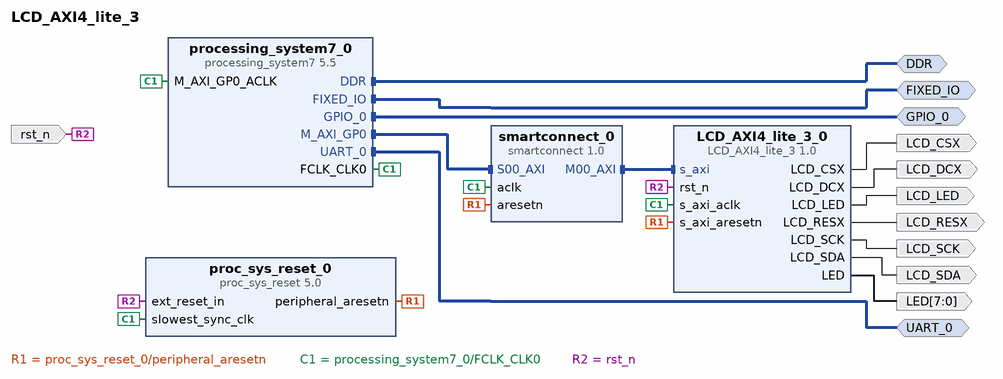
[diagram p0: block diagram of the top level]
# Vivado block design LCD_AXI4_lite_3, xc7z010clg400-1, Vivado 2025.1
create_bd_design LCD_AXI4_lite_3

create_bd_intf_port -mode Master -vlnv xilinx.com:interface:ddrx_rtl:1.0 DDR
create_bd_intf_port -mode Master -vlnv xilinx.com:display_processing_system7:fixedio_rtl:1.0 FIXED_IO
create_bd_intf_port -mode Master -vlnv xilinx.com:interface:gpio_rtl:1.0 GPIO_0
create_bd_intf_port -mode Master -vlnv xilinx.com:interface:uart_rtl:1.0 UART_0
create_bd_port -dir O -from 7 -to 0 LED
create_bd_port -dir O LCD_CSX
create_bd_port -dir O LCD_RESX
create_bd_port -dir O LCD_DCX
create_bd_port -dir O LCD_SDA
create_bd_port -dir O LCD_SCK
create_bd_port -dir O LCD_LED
create_bd_port -dir I -type rst rst_n

create_bd_cell -type ip -vlnv xilinx.com:ip:proc_sys_reset:5.0 proc_sys_reset_0
create_bd_cell -type ip -vlnv xilinx.com:ip:processing_system7:5.5 processing_system7_0
set_property -dict [list \
  CONFIG.PCW_EN_RST0_PORT 0 \
  CONFIG.PCW_GPIO_EMIO_GPIO_ENABLE 1 \
  CONFIG.PCW_GPIO_EMIO_GPIO_IO 64 \
  CONFIG.PCW_GPIO_MIO_GPIO_ENABLE 1 \
  CONFIG.PCW_GPIO_MIO_GPIO_IO MIO \
  CONFIG.PCW_I2C_RESET_ENABLE 1 \
  CONFIG.PCW_SD0_PERIPHERAL_ENABLE 0 \
  CONFIG.PCW_SD1_GRP_CD_ENABLE 1 \
  CONFIG.PCW_SD1_GRP_CD_IO {MIO 40} \
  CONFIG.PCW_SD1_GRP_WP_ENABLE 1 \
  CONFIG.PCW_SD1_GRP_WP_IO {MIO 41} \
  CONFIG.PCW_SD1_PERIPHERAL_ENABLE 1 \
  CONFIG.PCW_SD1_SD1_IO {MIO 34 .. 39} \
  CONFIG.PCW_SDIO_PERIPHERAL_FREQMHZ 100 \
  CONFIG.PCW_UART0_PERIPHERAL_ENABLE 1 \
  CONFIG.PCW_UART0_UART0_IO EMIO \
  CONFIG.PCW_UART1_PERIPHERAL_ENABLE 1 \
  CONFIG.PCW_UART1_UART1_IO {MIO 48 .. 49} \
  CONFIG.PCW_UART_PERIPHERAL_FREQMHZ 100 \
  CONFIG.PCW_UIPARAM_DDR_BUS_WIDTH {16 Bit} \
  CONFIG.PCW_UIPARAM_DDR_PARTNO {MT41J256M16 RE-125} \
  CONFIG.PCW_USB_RESET_ENABLE 1 \
] [get_bd_cells processing_system7_0]
# 204 more settings of processing_system7_0 are not shown: defaults, MIO pin electricals, DDR timing, and values the tool derives
create_bd_cell -type ip -vlnv xilinx.com:ip:smartconnect:1.0 smartconnect_0
set_property -dict {CONFIG.NUM_CLKS 1 CONFIG.NUM_SI 1} [get_bd_cells smartconnect_0]
create_bd_cell -type ip -vlnv user.org:user:LCD_AXI4_lite_3:1.0 LCD_AXI4_lite_3_0

# ---- connections ----

connect_bd_intf_net [get_bd_intf_ports DDR] [get_bd_intf_pins processing_system7_0/DDR]
connect_bd_intf_net [get_bd_intf_ports FIXED_IO] [get_bd_intf_pins processing_system7_0/FIXED_IO]
connect_bd_intf_net [get_bd_intf_pins processing_system7_0/GPIO_0] [get_bd_intf_ports GPIO_0]
connect_bd_intf_net [get_bd_intf_pins smartconnect_0/S00_AXI] [get_bd_intf_pins processing_system7_0/M_AXI_GP0]
connect_bd_intf_net [get_bd_intf_pins processing_system7_0/UART_0] [get_bd_intf_ports UART_0]
connect_bd_intf_net [get_bd_intf_pins LCD_AXI4_lite_3_0/s_axi] [get_bd_intf_pins smartconnect_0/M00_AXI]
connect_bd_net [get_bd_pins LCD_AXI4_lite_3_0/LCD_CSX] [get_bd_ports LCD_CSX]
connect_bd_net [get_bd_pins LCD_AXI4_lite_3_0/LCD_DCX] [get_bd_ports LCD_DCX]
connect_bd_net [get_bd_pins LCD_AXI4_lite_3_0/LCD_LED] [get_bd_ports LCD_LED]
connect_bd_net [get_bd_pins LCD_AXI4_lite_3_0/LCD_RESX] [get_bd_ports LCD_RESX]
connect_bd_net [get_bd_pins LCD_AXI4_lite_3_0/LCD_SCK] [get_bd_ports LCD_SCK]
connect_bd_net [get_bd_pins LCD_AXI4_lite_3_0/LCD_SDA] [get_bd_ports LCD_SDA]
connect_bd_net [get_bd_pins LCD_AXI4_lite_3_0/LED] [get_bd_ports LED]
connect_bd_net [get_bd_pins proc_sys_reset_0/peripheral_aresetn] [get_bd_pins smartconnect_0/aresetn] [get_bd_pins LCD_AXI4_lite_3_0/s_axi_aresetn]
connect_bd_net [get_bd_pins processing_system7_0/FCLK_CLK0] \
  [get_bd_pins processing_system7_0/M_AXI_GP0_ACLK] [get_bd_pins smartconnect_0/aclk] \
  [get_bd_pins proc_sys_reset_0/slowest_sync_clk] [get_bd_pins LCD_AXI4_lite_3_0/s_axi_aclk]
connect_bd_net [get_bd_ports rst_n] [get_bd_pins proc_sys_reset_0/ext_reset_in] [get_bd_pins LCD_AXI4_lite_3_0/rst_n]

# ---- address map ----
assign_bd_address -offset 0x43C00000 -range 64K -target_address_space [get_bd_addr_spaces processing_system7_0/Data] [get_bd_addr_segs LCD_AXI4_lite_3_0/s_axi/Reg]

validate_bd_design
save_bd_design
